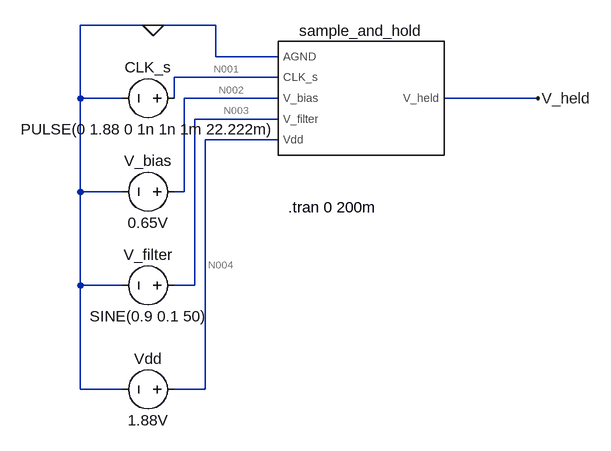
[diagram p0: schematic sample_and_hold_test.asc]
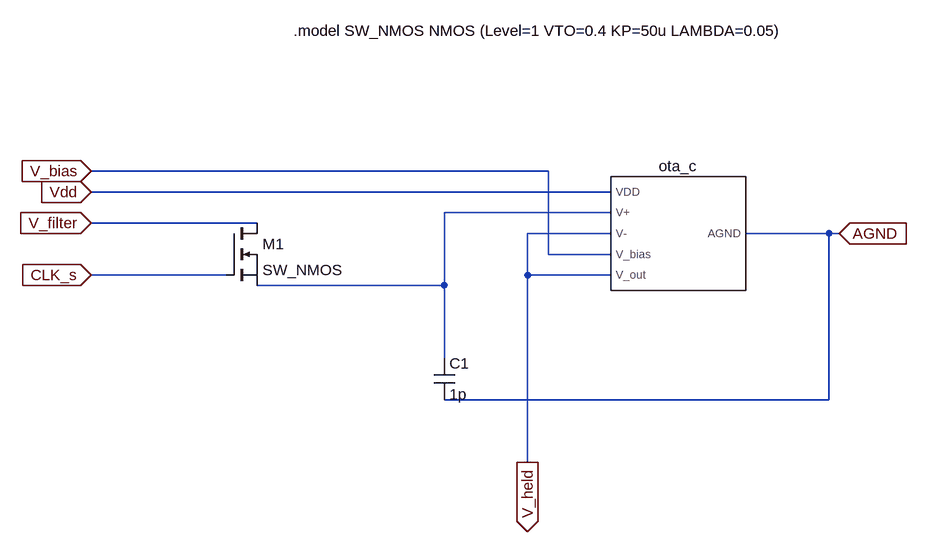
[diagram p1: sub-circuit sample_and_hold.asc]
sample_and_hold_test.asc, the LTspice schematic file:
Version 4.1
SHEET 1 880 680
WIRE -112 48 -224 48
WIRE -16 48 -112 48
WIRE -16 96 -16 48
WIRE 80 96 -16 96
WIRE 80 128 -80 128
WIRE -224 160 -224 48
WIRE -160 160 -224 160
WIRE -80 160 -80 128
WIRE 80 160 -64 160
WIRE 480 160 336 160
WIRE 80 192 -48 192
WIRE 80 224 -32 224
WIRE -224 304 -224 160
WIRE -160 304 -224 304
WIRE -64 304 -64 160
WIRE -64 304 -80 304
WIRE -224 448 -224 304
WIRE -160 448 -224 448
WIRE -48 448 -48 192
WIRE -48 448 -80 448
WIRE -224 608 -224 448
WIRE -160 608 -224 608
WIRE -32 608 -32 224
WIRE -32 608 -80 608
FLAG -112 48 0
FLAG 480 160 V_held
SYMBOL sample_and_hold 208 160 R0
SYMATTR InstName sample_and_hold
SYMBOL voltage -64 160 R90
WINDOW 0 -32 56 VBottom 2
WINDOW 3 32 56 VTop 2
WINDOW 123 0 0 Left 0
WINDOW 39 0 0 Left 0
SYMATTR InstName CLK_s
SYMATTR Value PULSE(0 1.88 0 1n 1n 1m 22.222m)
SYMBOL voltage -64 304 R90
WINDOW 0 -32 56 VBottom 2
WINDOW 3 32 56 VTop 2
SYMATTR InstName V_bias
SYMATTR Value 0.65V
SYMBOL voltage -64 448 R90
WINDOW 0 -32 56 VBottom 2
WINDOW 3 32 56 VTop 2
WINDOW 123 0 0 Left 0
WINDOW 39 0 0 Left 0
SYMATTR InstName V_filter
SYMATTR Value SINE(0.9 0.1 50)
SYMBOL voltage -64 608 R90
WINDOW 0 -32 56 VBottom 2
WINDOW 3 32 56 VTop 2
SYMATTR InstName Vdd
SYMATTR Value 1.88V
TEXT 96 328 Left 2 !.tran 0 200m

sample_and_hold.asc, the sub-circuit schematic file:
Version 4.1
SHEET 1 1152 680
WIRE 576 16 -128 16
WIRE 672 48 -128 48
WIRE 672 80 416 80
WIRE 128 96 -128 96
WIRE 672 112 544 112
WIRE 1008 112 880 112
WIRE 1024 112 1008 112
WIRE 576 144 576 16
WIRE 672 144 576 144
WIRE 80 176 -128 176
WIRE 544 176 544 112
WIRE 672 176 544 176
WIRE 416 192 416 80
WIRE 416 192 128 192
WIRE 416 304 416 192
WIRE 1008 368 1008 112
WIRE 1008 368 416 368
WIRE 544 464 544 176
FLAG -128 96 V_filter
IOPIN -128 96 In
FLAG -128 48 Vdd
IOPIN -128 48 In
FLAG -128 176 CLK_s
IOPIN -128 176 In
FLAG -128 16 V_bias
IOPIN -128 16 In
FLAG 1024 112 AGND
IOPIN 1024 112 In
FLAG 544 464 V_held
IOPIN 544 464 Out
SYMBOL nmos 80 96 R0
SYMATTR InstName M1
SYMATTR Value SW_NMOS
SYMBOL ota_core 768 112 R0
SYMATTR InstName ota_c
SYMBOL cap 400 304 R0
SYMATTR InstName C1
SYMATTR Value 1p
TEXT 184 -200 Left 2 !.model SW_NMOS NMOS (Level=1 VTO=0.4 KP=50u LAMBDA=0.05)

The netlist it stands for:
* sample_and_hold_test.asc
X§sample_and_hold 0 N001 N002 N003 N004 V_held sample_and_hold
V§CLK_s N001 0 PULSE(0 1.88 0 1n 1n 1m 22.222m)
V_bias N002 0 0.65V
V_filter N003 0 SINE(0.9 0.1 50)
Vdd N004 0 1.88V

* block symbol definitions
.subckt sample_and_hold AGND CLK_s V_bias V_filter Vdd V_held
M1 V_filter CLK_s N001 N001 SW_NMOS
X§ota_c Vdd N001 V_held V_bias V_held AGND ota_core  ; pins VDD V+ V- V_bias V_out AGND
C1 N001 AGND 1p
.model SW_NMOS NMOS (Level=1 VTO=0.4 KP=50u LAMBDA=0.05)
.ends sample_and_hold

.model NMOS NMOS
.model PMOS PMOS
.lib standard.mos
.tran 0 200m
.backanno
.end

* Results of the author's LTspice run, read from the files saved beside the schematic
* Operating Point, zero values left out:
*   V(n002) = 650 mV
*   V(n003) = 900 mV
*   V(n004) = 1.88 V
*   V(v_held) = 900.7 mV
*   I(Vdd) = -319.9 nA
*   Ix(sample_and_hold:agnd) = -319.9 nA
*   Ix(sample_and_hold:vdd) = 319.9 nA
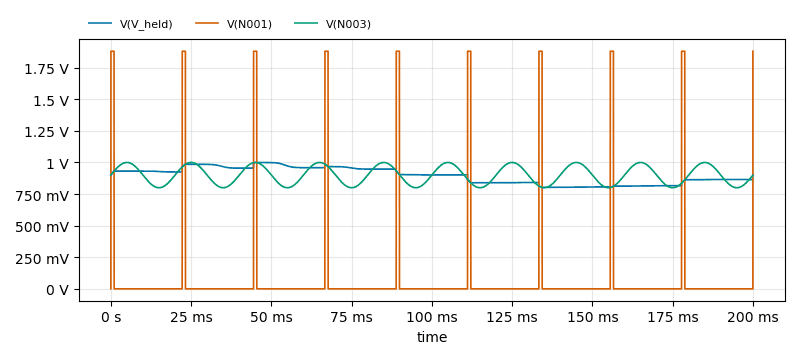
[diagram p2: Transient Analysis of sample_and_hold_test.asc, plotted from the saved traces]
* Transient Analysis, 1 run:
*   V(V_held): min 802.3 mV, max 1.001 V, average 895.4 mV, rms 897.6 mV, last 900.7 mV
*   V(N001): min 0 V, max 1.88 V, average 84.62 mV, rms 398.9 mV, last 1.88 V
*   V(N003): min 800 mV, max 1 V, average 900 mV, rms 902.8 mV, last 900 mV